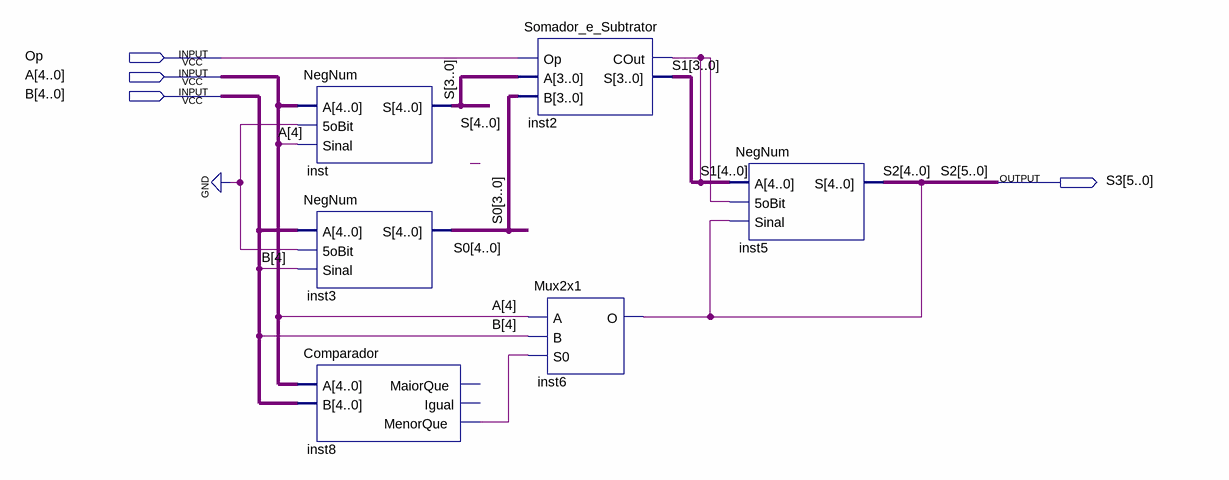
[diagram p0: schematic sheet]
// Quartus schematic SumESub.bdf as structural Verilog: 6 symbols, 4 pins
module SumESub (
  input  Op,
  input  [4:0] A,
  input  [4:0] B,
  output [5:0] S3
);

  wire inst2_cout, inst6_o, inst8_menorque;
  wire [4:0] S, S0, S1;

  NegNum inst (.A(A), .\5oBit (1'b0), .Sinal(A[4]), .S(S));
  NegNum inst3 (.A(B), .\5oBit (1'b0), .Sinal(B[4]), .S(S0));
  Comparador inst8 (.A(A), .B(B), .MenorQue(inst8_menorque));  // open: MaiorQue, Igual
  Somador_e_Subtrator inst2 (.Op(Op), .A(S[3:0]), .B(S0[3:0]), .COut(inst2_cout), .S(S1[3:0]));
  Mux2x1 inst6 (.A(A[4]), .B(B[4]), .S0(inst8_menorque), .O(inst6_o));
  NegNum inst5 (.A(S1), .\5oBit (inst2_cout), .Sinal(inst6_o), .S(S3[4:0]));

  // Other names for the same wires on the sheet: S2[5:0] = S3
endmodule
